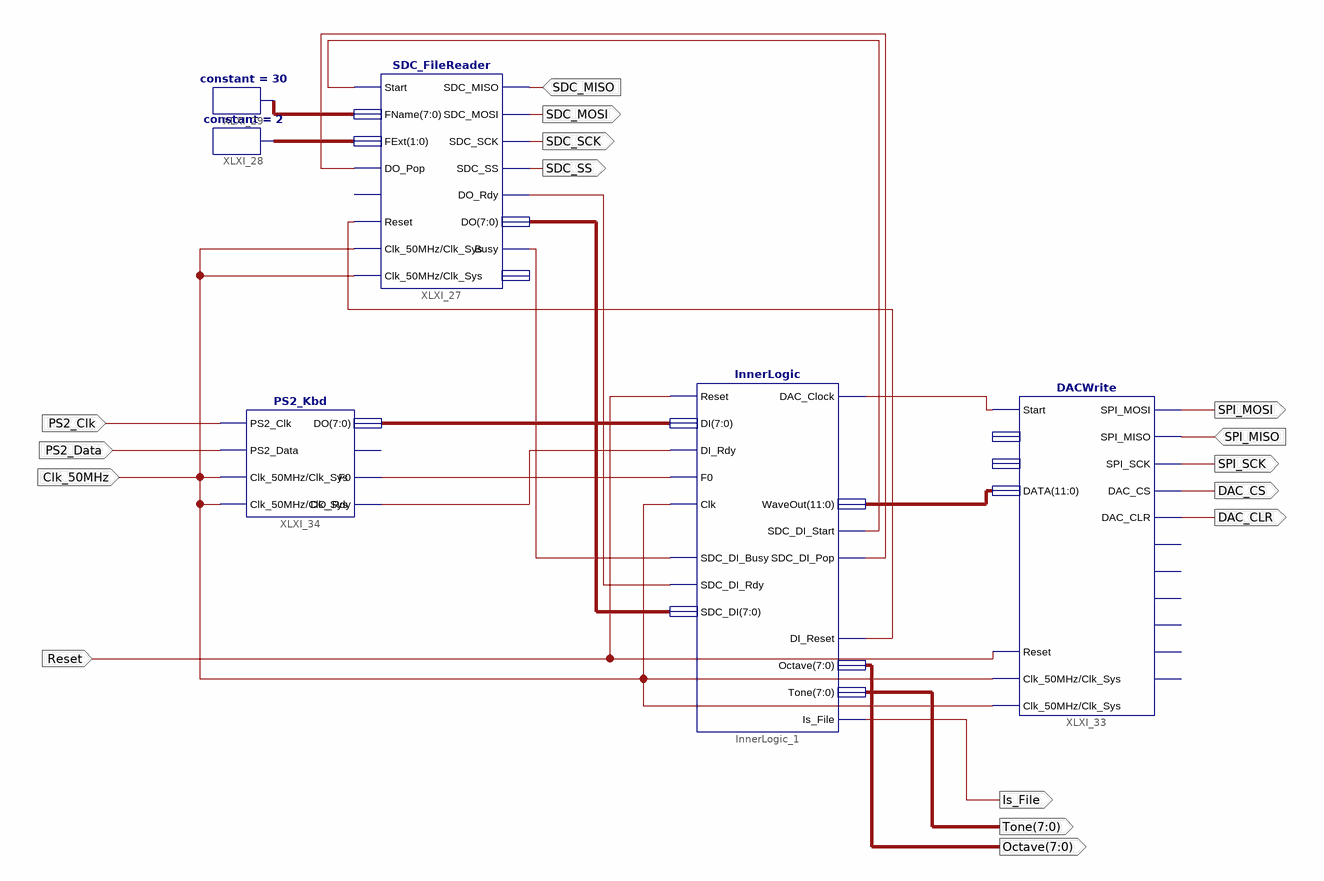
[diagram p0: schematic sheet 1]
// Xilinx ISE schematic main.sch (spartan3e) as structural Verilog: 6 symbols, 16 ports
module main (
  input  Clk_50MHz,
  input  Reset,
  input  PS2_Data,
  input  PS2_Clk,
  input  SDC_MISO,
  input  SPI_MISO,
  output SDC_SS,
  output SDC_MOSI,
  output SDC_SCK,
  output SPI_MOSI,
  output DAC_CS,
  output DAC_CLR,
  output SPI_SCK,
  output [7:0] Tone,
  output [7:0] Octave,
  output Is_File
);

  wire XLXN_114, XLXN_118, XLXN_119, XLXN_151, XLXN_152, XLXN_153, XLXN_154, XLXN_165;
  wire [1:0] XLXN_130;
  wire [7:0] XLXN_116, XLXN_129, XLXN_155;
  wire [11:0] XLXN_115;

  InnerLogic InnerLogic_1 (
    .SDC_DI_Busy(XLXN_154), .SDC_DI(XLXN_155), .SDC_DI_Rdy(XLXN_153), .DI(XLXN_116), .F0(XLXN_119),
    .DI_Rdy(XLXN_118), .Reset(Reset), .Clk(Clk_50MHz), .SDC_DI_Pop(XLXN_152), .SDC_DI_Start(XLXN_151),
    .DI_Reset(XLXN_165), .Octave(Octave), .Tone(Tone), .WaveOut(XLXN_115), .DAC_Clock(XLXN_114),
    .Is_File(Is_File));
  SDC_FileReader XLXI_27 (
    .SDC_MISO(SDC_MISO), .Start(XLXN_151), .FName(XLXN_129), .Reset(XLXN_165), .Clk_50MHz(Clk_50MHz),
    .DO_Pop(XLXN_152), .SDC_MOSI(SDC_MOSI), .SDC_SCK(SDC_SCK), .SDC_SS(SDC_SS), .DO(XLXN_155),
    .DO_Rdy(XLXN_153), .Busy(XLXN_154), .FExt(XLXN_130), .Clk_Sys(Clk_50MHz));  // open: Abort, Error
  constant #(.CValue("30")) XLXI_29 (.O(XLXN_129));
  constant #(.CValue("2")) XLXI_28 (.O(XLXN_130));
  DACWrite XLXI_33 (
    .Reset(Reset), .Start(XLXN_114), .SPI_MISO(SPI_MISO), .DATA(XLXN_115), .DAC_CLR(DAC_CLR),
    .DAC_CS(DAC_CS), .SPI_MOSI(SPI_MOSI), .SPI_SCK(SPI_SCK), .Clk_50MHz(Clk_50MHz), .Clk_Sys(Clk_50MHz));  // open: Cmd, Addr, SPI_SS_B, AMP_CS, AD_CONV, SF_CE0, FPGA_INIT_B, Busy
  PS2_Kbd XLXI_34 (
    .PS2_Clk(PS2_Clk), .PS2_Data(PS2_Data), .Clk_50MHz(Clk_50MHz), .F0(XLXN_119), .DO_Rdy(XLXN_118),
    .DO(XLXN_116), .Clk_Sys(Clk_50MHz));  // open: E0
endmodule
